# EAGLE schematic schematic (EAGLE 9.6.2)

## Sheet 1 of 2
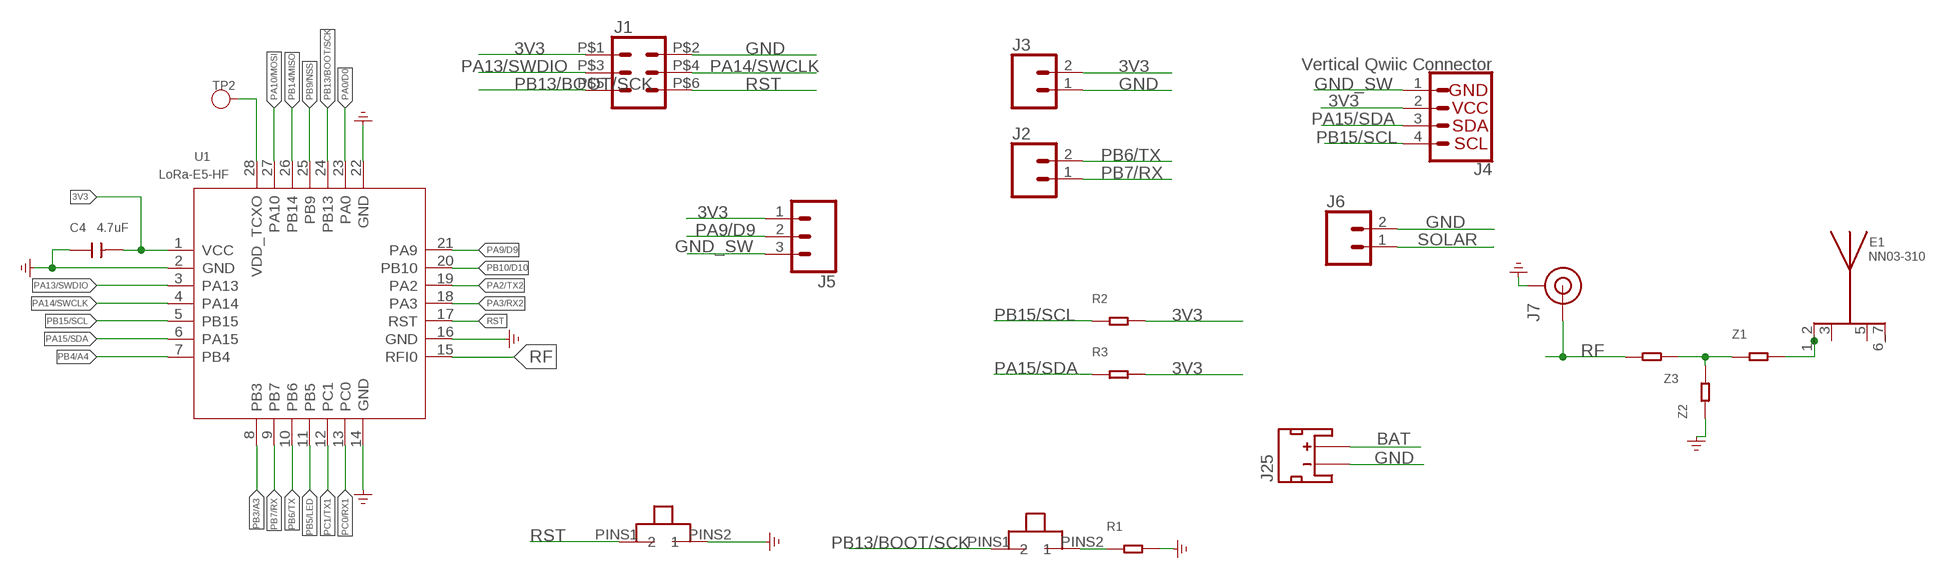
[diagram p0: schematic, sheet 1]

### Parts
C4  4.7uF  CAP-0603  [C0603]
E1  NN03-310  [XCVR_NN03-310]
J1  CONN_03X2POGO_PINS  [2X3_POGO]
J2  CONN_02  [1X02]
J3  CONN_02  [1X02]
J4  Vertical Qwiic Connector  QWIIC_CONNECTOR  [JST04_1MM_VERT]
J5  CONN_031X03_NO_SILK  [1X03_NO_SILK]
J6  CONN_02  [1X02]
J7  U.FL2PIN-REDUCED-FOOTPRINT  [U.FL_REDUCED_FOOTPRINT]
J25  JST_2MM_MALE  [JST-2-SMD]
R1  RES-0603  [R0603]
R2  RES-0603  [R0603]
R3  RES-0603  [R0603]
TP2  TEST  TEST-POINT'4545'  [TP-D45MIL]
U1  LoRa-E5-HF  MOUDLE_LORA_E5  [MOUDLE28P-1.25-12X12X2.5MM]
U$1  TACTILE  [TACTILE]
U$2  TACTILE  [TACTILE]
Z1  RES-0603  [R0603]
Z2  RES-0603  [R0603]
Z3  RES-0603  [R0603]

### Nets
3V3: C4.2 J1.P$1 J3.2 J4.2 J5.1 R2.2 R3.2 U1.1(VCC) ; also sheet 2
BAT: J25.2(+) ; also sheet 2
GND: C4.1 J1.P$2 J3.1 J6.2 J7.1(GND) J7.2(GND) J25.1(-) R1.2 U1.2(GND) U1.14(GND) U1.16(GND) U1.22(GND) U$1.PINS2 Z2.1 ; supply symbol labelled GND_POWER ; also sheet 2
GND_SW: J4.1 J5.3 ; also sheet 2
N$1: E1.1_2 Z1.2
N$2: R1.1 U$2.PINS2
N$4: Z1.1 Z2.2 Z3.1
N$19: TP2.T U1.28(VDD_TCXO)
PA0/D0: U1.23(PA0) ; also sheet 2
PA2/TX2: U1.19(PA2)
PA3/RX2: U1.18(PA3)
PA9/D9: J5.2 U1.21(PA9)
PA10/MOSI: U1.27(PA10)
PA13/SWDIO: J1.P$3 U1.3(PA13)
PA14/SWCLK: J1.P$4 U1.4(PA14)
PA15/SDA: J4.3 R3.1 U1.6(PA15)
PB3/A3: U1.8(PB3)
PB4/A4: U1.7(PB4)
PB5/LED: U1.11(PB5)
PB6/TX: J2.2 U1.10(PB6)
PB7/RX: J2.1 U1.9(PB7)
PB9/NSS: U1.25(PB9)
PB10/D10: U1.20(PB10)
PB13/BOOT/SCK: J1.P$5 U1.24(PB13) U$2.PINS1
PB14/MISO: U1.26(PB14)
PB15/SCL: J4.4 R2.1 U1.5(PB15)
PC0/RX1: U1.13(PC0)
PC1/TX1: U1.12(PC1)
RF: J7.FEED(SIGNAL) U1.15(RFI0) Z3.2
RST: J1.P$6 U1.17(RST) U$1.PINS1
SOLAR: J6.1 ; also sheet 2
Unconnected: E1.3 E1.5 E1.6_7 J25.NC1(PAD1) J25.NC2(PAD2)

## Sheet 2 of 2
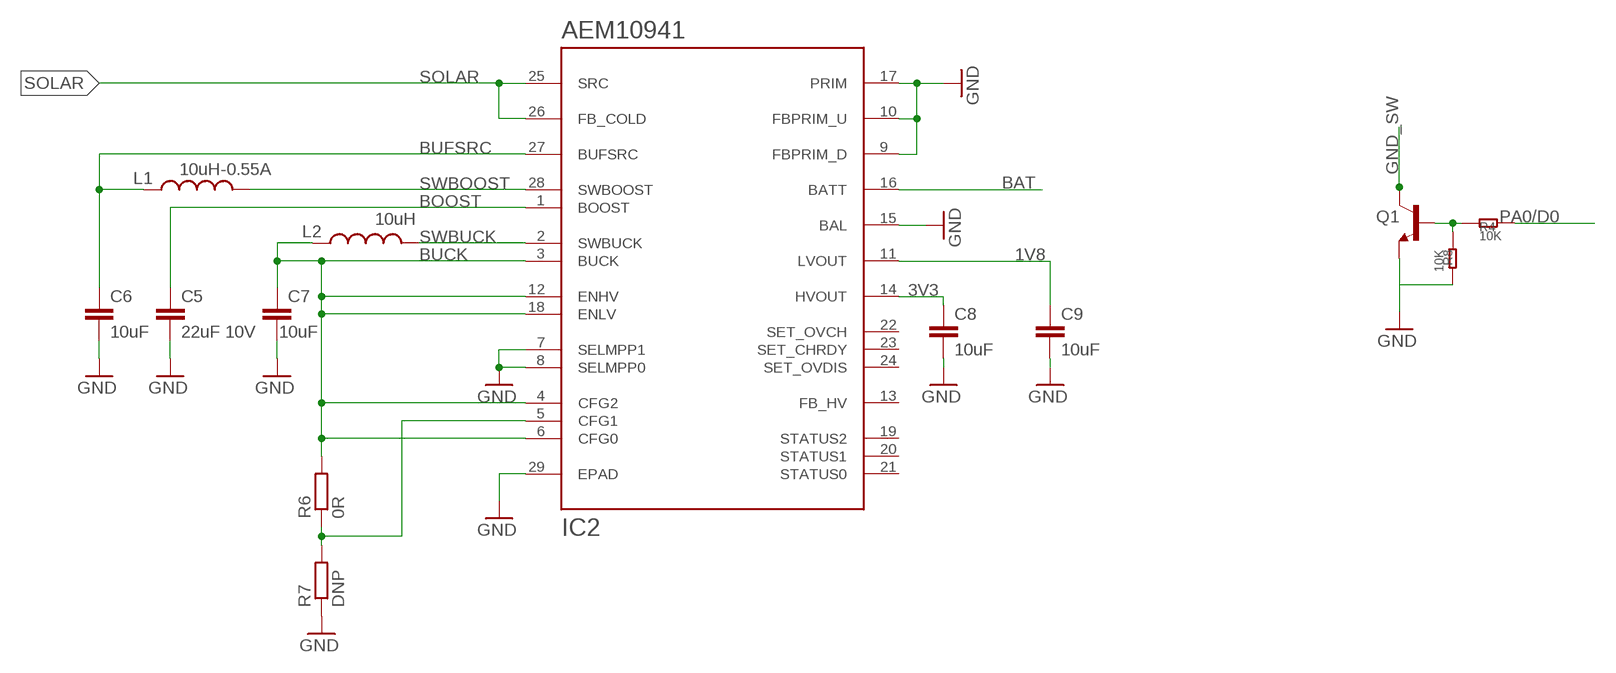
[diagram p1: schematic, sheet 2]

### Parts
C5  22uF 10V  C0603_22UF  [C0603]
C6  10uF  C0603_10UF  [C0603]
C7  10uF  C0603_10UF  [C0603]
C8  10uF  C0603_10UF  [C0603]
C9  10uF  C0603_10UF  [C0603]
IC2  AEM10941  [QFN50P505X505X90-28]
L1  10uH-0.55A  L3.9X3.9_10UH_0.55A  [LPS4012]
L2  10uH  L0603_10UH  [L0603]
Q1  500mA/300V  TRANS_NPN-MMBTA42  [SOT23-3]
R4  10K  RES-0603  [R0603]
R6  0R  R0402_1M  [R0402]
R7  DNP  R0402_1M  [R0402]
R8  10K  RES-0603  [R0603]

### Nets
1V8: C9.1 IC2.11(LVOUT)
3V3: C8.1 IC2.14(HVOUT) ; also sheet 1
BAT: IC2.16(BATT) ; also sheet 1
BOOST: C5.1 IC2.1(BOOST)
BUCK: C7.1 IC2.3(BUCK) IC2.4(CFG2) IC2.6(CFG0) IC2.12(ENHV) IC2.18(ENLV) L2.1 R6.2
BUFSRC: C6.1 IC2.27(BUFSRC) L1.1
GND: C5.2 C6.2 C7.2 C8.2 C9.2 IC2.7(SELMPP1) IC2.8(SELMPP0) IC2.9(FBPRIM_D) IC2.10(FBPRIM_U) IC2.15(BAL) IC2.17(PRIM) IC2.29(EPAD) Q1.2(E) R7.1 R8.2 ; also sheet 1
GND_SW: Q1.3(C) ; also sheet 1
N$3: IC2.5(CFG1) R6.1 R7.2
N$5: Q1.1(B) R4.1 R8.1
PA0/D0: R4.2 ; also sheet 1
SOLAR: IC2.25(SRC) IC2.26(FB_COLD) ; also sheet 1
SWBOOST: IC2.28(SWBOOST) L1.2
SWBUCK: IC2.2(SWBUCK) L2.2
Unconnected: IC2.13(FB_HV) IC2.19(STATUS2) IC2.20(STATUS1) IC2.21(STATUS0) IC2.22(SET_OVCH) IC2.23(SET_CHRDY) IC2.24(SET_OVDIS)

## Library data of the parts
C4 = Discrete-new:CAP: Ceramic Capacitors
C5 = TSEM:C: Non-polarized capacitor; FARNELL_OC: 2426957; MF: TDK; MPN: CGA5L1X7S1A226M160AC; OC_NEWARK: 71AH2845
C6-C9 = TSEM:C: Non-polarized capacitor; FARNELL_OC: 2113070; MF: KEYSTONE; MPN: 1049P; OC_NEWARK: 53Y2625
E1 = NN03-310:NN03-310: 700MHz, 800MHz, 850MHz, 900MHz, 1.7GHz, 1.8GHz, 1.9GHz, 2GHz, 2.1GHz, 2.3GHz, 2.5GHz, 2.6GHz DCS, GSM, LTE, PCS, UMTS Chip RF Antenna 698MHz ~ 960MHz, 1.71GHz ~ 2.69GHz 1.1dBi, 2.4dBi Solder Surface Mount Check availability <https://pricing.snapeda.com/parts/NN03-310/Ignion/view-part?ref=eda>; AVAILABILITY: In Stock; DESCRIPTION: Multiport top performance chip antenna component for GSM, UMTS, LTE, 5G, GNSS, Bluetooth (617 - 960MHz, 1710 - 2690MHz, 3300 - 3800MHz, 1561 - 1606 MHz and 2400 - 2500 MHz), signal booster; MF: Ignion; MP: NN03-310; PACKAGE: None; PRICE: None; PURCHASE-URL: https://pricing.snapeda.com/search/part/NN03-310/?ref=eda
IC2 = TSEM:AEM10941: Ambient Energy Manager from e-peas; OC_NEWARK: unknown
J1 = SparkFun-Connectors:CONN_03X2: Multi connection point. Often used as Generic Header-pin footprint for 0.1 inch spaced/style header connections You can populate with any combo of single row headers, but if you'd like an exact match, check these: Header - 2x3 (Male, 0.1") <https://www.sparkfun.com/products/12807> (PRT-12807) Header - 2x3 (Female, 0.1") <https://www.sparkfun.com/products/13010> (PRT-13010) 2x3 Pin Shrouded Header <https://www.sparkfun.com/products/10877> (PRT-10877) On any of the 0.1 inch spaced packages, you can populate with these: Break Away Headers - Straight <https://www.sparkfun.com/products/116> (PRT-00116) Break Away Male Headers - Right Angle <https://www.sparkfun.com/products/553> (PRT-00553) Female Headers <https://www.sparkfun.com/products/115> (PRT-00115) Break Away Headers - Machine Pin <https://www.sparkfun.com/products/117> (PRT-00117) Break Away Female Headers - Swiss Machine Pin <https://www.sparkfun.com/products/743> (PRT-00743) Special note: the shrouded connector mates well with our 3x2 ribbon cables: Ribbon Crimp Connector - 6-pin (2x3, Female) <https://www.sparkfun.com/products/10651> (PRT-10651) Ribbon Cable - 6 wire (15ft) <https://www.sparkfun.com/products/10646> (PRT-10646); PROD_ID: HW-11044
J2 J3 J6 = SparkFun-Connectors:CONN_02: Multi connection point. Often used as Generic Header-pin footprint for 0.1 inch spaced/style header connections On any of the 0.1 inch spaced packages, you can populate with these: Break Away Headers - Straight <https://www.sparkfun.com/products/116> (PRT-00116) Break Away Male Headers - Right Angle <https://www.sparkfun.com/products/553> (PRT-00553) Female Headers <https://www.sparkfun.com/products/115> (PRT-00115) Break Away Headers - Machine Pin <https://www.sparkfun.com/products/117> (PRT-00117) Break Away Female Headers - Swiss Machine Pin <https://www.sparkfun.com/products/743> (PRT-00743) For SCREWTERMINALS and SPRING TERMINALS visit here: Screw Terimnals on SparkFun.com <https://www.sparkfun.com/search/results?term=Screw+Terminals> (5mm/3.5mm/2.54mm spacing) This device is also useful as a general connection point to wire up your design to another part of your project. Our various solder wires solder well into these plated through hole pads. Hook-Up Wire - Assortment (Stranded, 22 AWG) <https://www.sparkfun.com/products/11375> (PRT-11375) Hook-Up Wire - Assortment (Solid Core, 22 AWG) <https://www.sparkfun.com/products/11367> (PRT-11367) View the entire wire category on our website here <https://www.sparkfun.com/categories/141> Special notes: Molex polarized connector foot print use with: PRT-08233 with associated crimp pins and housings. 2.54_SCREWTERM for use with PRT-10571. 3.5mm Screw Terminal footprints for PRT-08084 5mm Screw Terminal footprints for use with PRT-08432
J4 = SparkFun-Connectors:QWIIC_CONNECTOR: SparkFun I2C Standard Qwiic Connector An SMD 1mm pitch JST connector makes it easy and quick (get it? Qwiic?) to connect I2C devices to each other. The Qwiic system <http://www.sparkfun.com/qwiic> enables fast and solderless connection between popular platforms and various sensors and actuators. We carry 200mm <https://www.sparkfun.com/products/14204>, 100mm <https://www.sparkfun.com/products/14205>, 50mm <https://www.sparkfun.com/products/14206>, and breadboard friendly <https://www.sparkfun.com/products/14207> Qwiic cables. We also offer 10 pcs strips <https://www.sparkfun.com/products/14323> the SMD connectors.; PROD_ID: CONN-14483
J5 = SparkFun-Connectors:CONN_03: Multi connection point. Often used as Generic Header-pin footprint for 0.1 inch spaced/style header connections On any of the 0.1 inch spaced packages, you can populate with these: Break Away Headers - Straight <https://www.sparkfun.com/products/116> (PRT-00116) Break Away Male Headers - Right Angle <https://www.sparkfun.com/products/553> (PRT-00553) Female Headers <https://www.sparkfun.com/products/115> (PRT-00115) Break Away Headers - Machine Pin <https://www.sparkfun.com/products/117> (PRT-00117) Break Away Female Headers - Swiss Machine Pin <https://www.sparkfun.com/products/743> (PRT-00743) Stackable Header - 3 Pin (Female, 0.1") <https://www.sparkfun.com/products/13875> (PRT-13875) For SCREWTERMINALS and SPRING TERMINALS visit here: Screw Terimnals on SparkFun.com <https://www.sparkfun.com/search/results?term=Screw+Terminals> (5mm/3.5mm/2.54mm spacing) This device is also useful as a general connection point to wire up your design to another part of your project. Our various solder wires solder well into these plated through hole pads. Hook-Up Wire - Assortment (Stranded, 22 AWG) <https://www.sparkfun.com/products/11375> (PRT-11375) Hook-Up Wire - Assortment (Solid Core, 22 AWG) <https://www.sparkfun.com/products/11367> (PRT-11367) View the entire wire category on our website here <https://www.sparkfun.com/categories/141> Special notes: Molex polarized connector foot print use with SKU : PRT-08232 with associated crimp pins and housings.
J7 = SparkFun-Connectors:U.FL2PIN: SMD Antenna Connector - U.FL 2mm height, 3.0mm x 3.0mm receptacle size. SparkFun Products: SparkFun WiFi Shield - ESP8266 <https://www.sparkfun.com/products/13287> SparkFun ESP8266 Thing <https://www.sparkfun.com/products/13231> SparkFun MiniGen - Pro Mini Signal Generator Shield <https://www.sparkfun.com/products/11420>; PROD_ID: CONN-09193
J25 = SparkFun-Connectors:JST_2MM_MALE: JST 2MM MALE RA CONNECTOR Two pin, compact surface mount connector. Commonly used as a battery input connection point. We really like the solid locking feeling and high current rating on these small connectors. We use these all the time as battery connectors. Mates to single-cell LiPo batteries. Here is the connector we sell at SparkFun: JST Right Angle Connector - White <https://www.sparkfun.com/products/8612> (PRT-08612) Datasheet <http://www.sparkfun.com/datasheets/Prototyping/Connectors/JST-Horizontal.pdf> It was used on these SparkFun products: SparkFun MOSFET Power Controller <https://www.sparkfun.com/products/11214> (PRT-11214) SparkFun Battery Babysitter - LiPo Battery Manager <https://www.sparkfun.com/products/13777> (PRT-13777) And many, many others that required a lipo battery connection.; PROD_ID: CONN-11443; SF_ID: PRT-08612
L1 = TSEM:L: Inductor; FARNELL_OC: 2408076; MF: BOURNS; MPN: SRN2009T-100M; OC_NEWARK: 43AC9502
L2 = TSEM:L: Inductor; FARNELL_OC: 2215635; MF: TAIYO YUDEN; MPN: CK2125100M-T; OC_NEWARK: 25AC6883
Q1 = SparkFun-DiscreteSemi:TRANS_NPN: NPN transistor Current controlled devices typically used to amplify current or used as a switch. BC547 - COM-08928 <http://www.sparkfun.com/products/8928> (TO-92 45V 100mA) (1.Collector 2.Base 3.Emitter) 2N3904 - COM-00521 <http://www.sparkfun.com/products/521> (TO-92 40V 200mA) (1.Emitter 2.Base 3.Collector) P2N2222A - COM-12852 <http://www.sparkfun.com/products/12852> (TO-92 40V 600mA) (1.Collector 2.Base 3.Emitter); PROD_ID: TRANS-09116
R1-R4 R8 Z1-Z3 = RAK3172-Breakout:RES
R6 R7 = TSEM:R: Resistor; FARNELL_OC: 2502499; OC_NEWARK: unknown; VALUE: 1M
TP2 = Discrete-new:TEST-POINT; PARTNO: DNP
U1 = moudle-new:MOUDLE_LORA_E5
U$1 U$2 = Tactile-3x6x4.3:TACTILE